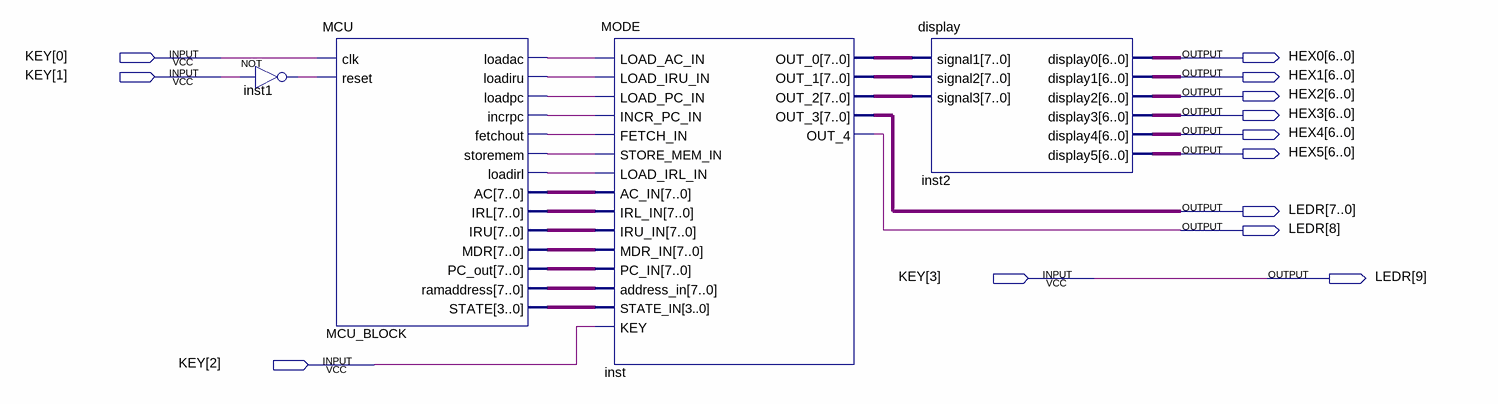
[diagram p0: schematic sheet]
// Quartus schematic mcu_tb.bdf as structural Verilog: 4 symbols, 13 pins
module mcu_tb (
  input  [3:0] KEY,
  output [6:0] HEX0,
  output [6:0] HEX1,
  output [6:0] HEX2,
  output [6:0] HEX3,
  output [6:0] HEX4,
  output [6:0] HEX5,
  output [9:0] LEDR
);

  wire inst1_out, MCU_BLOCK_fetchout, MCU_BLOCK_incrpc, MCU_BLOCK_loadac, MCU_BLOCK_loadirl,
       MCU_BLOCK_loadiru, MCU_BLOCK_loadpc, MCU_BLOCK_storemem;
  wire [3:0] MCU_BLOCK_state;
  wire [7:0] inst_out_0, inst_out_1, inst_out_2, MCU_BLOCK_ac, MCU_BLOCK_irl, MCU_BLOCK_iru, MCU_BLOCK_mdr,
       MCU_BLOCK_pc_out, MCU_BLOCK_ramaddress;

  not inst1 (inst1_out, KEY[1]);
  MCU MCU_BLOCK (
    .clk(KEY[0]), .reset(inst1_out), .loadac(MCU_BLOCK_loadac), .loadiru(MCU_BLOCK_loadiru),
    .loadpc(MCU_BLOCK_loadpc), .incrpc(MCU_BLOCK_incrpc), .fetchout(MCU_BLOCK_fetchout),
    .storemem(MCU_BLOCK_storemem), .loadirl(MCU_BLOCK_loadirl), .AC(MCU_BLOCK_ac), .IRL(MCU_BLOCK_irl),
    .IRU(MCU_BLOCK_iru), .MDR(MCU_BLOCK_mdr), .PC_out(MCU_BLOCK_pc_out), .ramaddress(MCU_BLOCK_ramaddress),
    .STATE(MCU_BLOCK_state));
  MODE inst (
    .LOAD_AC_IN(MCU_BLOCK_loadac), .LOAD_IRU_IN(MCU_BLOCK_loadiru), .LOAD_PC_IN(MCU_BLOCK_loadpc),
    .INCR_PC_IN(MCU_BLOCK_incrpc), .FETCH_IN(MCU_BLOCK_fetchout), .STORE_MEM_IN(MCU_BLOCK_storemem),
    .LOAD_IRL_IN(MCU_BLOCK_loadirl), .AC_IN(MCU_BLOCK_ac), .IRL_IN(MCU_BLOCK_irl), .IRU_IN(MCU_BLOCK_iru),
    .MDR_IN(MCU_BLOCK_mdr), .PC_IN(MCU_BLOCK_pc_out), .address_in(MCU_BLOCK_ramaddress),
    .STATE_IN(MCU_BLOCK_state), .KEY(KEY[2]), .OUT_0(inst_out_0), .OUT_1(inst_out_1), .OUT_2(inst_out_2),
    .OUT_3(LEDR[7:0]), .OUT_4(LEDR[8]));
  display inst2 (
    .signal1(inst_out_0), .signal2(inst_out_1), .signal3(inst_out_2), .display0(HEX0), .display1(HEX1),
    .display2(HEX2), .display3(HEX3), .display4(HEX4), .display5(HEX5));

  assign LEDR[9] = KEY[3];
endmodule
